# Altium schematic sheet Buzzer.SchDoc
size A4; Organization: Altium Limited; Address1: L3, 12a Rodborough Rd; Address2: Frenchs Forest; Address3: NSW; Address4: Australia 2086; DocumentNumber: 2; SheetNumber: 2; SheetTotal: 3
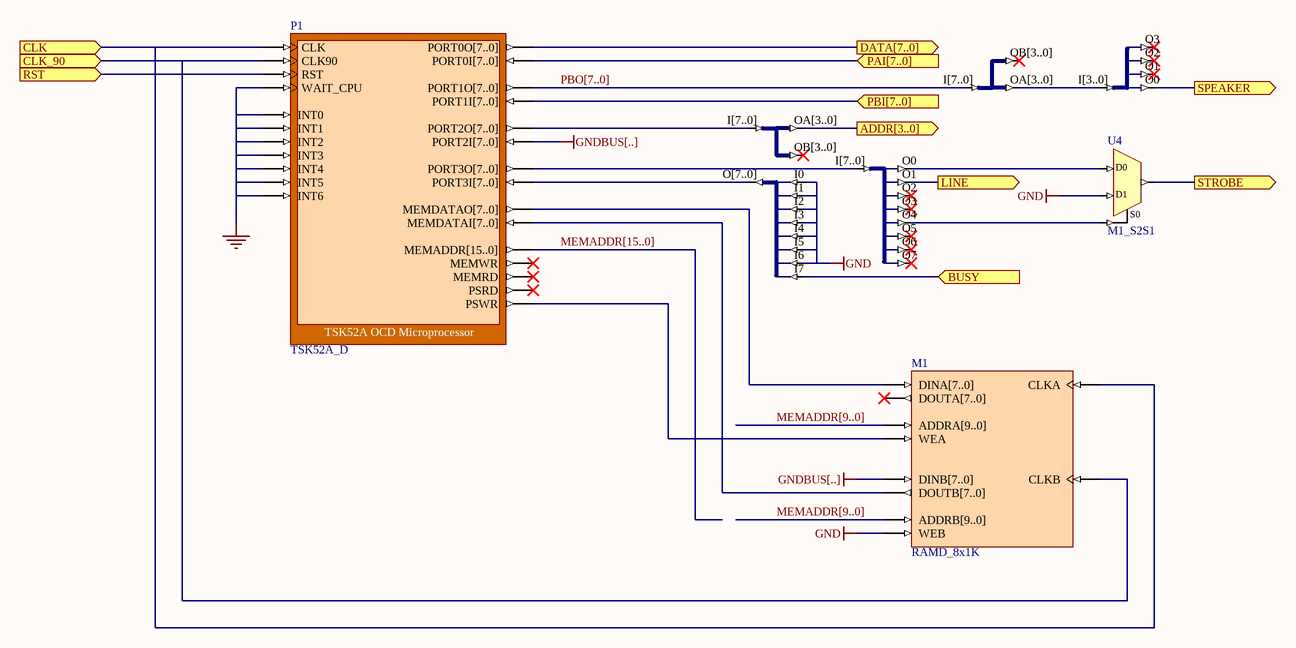
[diagram p0: Buzzer.SchDoc]

## Parts
M1  RAMD_8x1K
P1  TSK52A_D
U1  J4B_4S  (value not drawn)
U2  J8B_4B2  (value not drawn)
U3  J8B_4B2  (value not drawn)
U4  M1_S2S1
U5  J8B_8S  (value not drawn)
U6  J8S_8B  (value not drawn)

## Ports
ADDR[3..0] (out), BUSY (in), CLK (in), CLK_90 (in), DATA[7..0] (out), LINE (out), PAI[7..0] (in), PBI[7..0] (in), RST (in), SPEAKER (out), STROBE (out)

## Nets
GND: M1.WEB P1.INT0 P1.INT1 P1.INT2 P1.INT3 P1.INT4 P1.INT5 P1.INT6 P1.WAIT_CPU U4.D1 U6.I0 U6.I1 U6.I2 U6.I3 U6.I4 U6.I5 U6.I6
GNDBUS[..]: M1.DINB[7..0] P1.PORT2I[7..0]
ADDR[3..0]: U3.OA[3..0] ; port ADDR[3..0]
BUSY: U6.I7 ; port BUSY
CLK: M1.CLKA P1.CLK ; port CLK
CLK_90: M1.CLKB P1.CLK90 ; port CLK_90
DATA[7..0]: P1.PORT0O[7..0] ; port DATA[7..0]
LINE: U5.O1 ; port LINE
MEMADDR[9..0]: M1.ADDRA[9..0] M1.ADDRB[9..0]
MEMADDR[15..0]: P1.MEMADDR[15..0]
PAI[7..0]: P1.PORT0I[7..0] ; port PAI[7..0]
PBI[7..0]: P1.PORT1I[7..0] ; port PBI[7..0]
PBO[7..0]: P1.PORT1O[7..0] U2.I[7..0]
RST: P1.RST ; port RST
SPEAKER: U1.O0 ; port SPEAKER
STROBE: U4.O ; port STROBE
NetM1_DINA[7..0]: M1.DINA[7..0] P1.MEMDATAO[7..0]
NetM1_DOUTB[7..0]: M1.DOUTB[7..0] P1.MEMDATAI[7..0]
NetM1_WEA: M1.WEA P1.PSWR
NetP1_PORT2O[7..0]: P1.PORT2O[7..0] U3.I[7..0]
NetP1_PORT3I[7..0]: P1.PORT3I[7..0] U6.O[7..0]
NetP1_PORT3O[7..0]: P1.PORT3O[7..0] U5.I[7..0]
NetU1_I[3..0]: U1.I[3..0] U2.OA[3..0]
NetU4_D0: U4.D0 U5.O0
NetU4_S0: U4.S0 U5.O4

Not connected (* = marked no-connect by the designer): M1 DOUTA[7..0]*; P1 MEMRD* MEMWR* PSRD*; U1 O1* O2* O3*; U2 OB[3..0]*; U3 OB[3..0]*; U5 O2* O3* O5* O6* O7*

## Buses and harness runs
bus MEMADDR[9..0]
bus MEMADDR[15..0]
bus PBO[7..0]

## Notes on the sheet
- Title
- Size:
- Date:
- A4
- Number:
- Time:
- Revision:
- Sheet
- of
- File:

## Library data of the parts
M1 = RAMD_8x1K: Dual Port Random Access Memory; Memory_DepthA: 1024; Memory_Type: RAM_DualPortBlock; Memory_WidthA: 8; Memory_ClockEdge: Rising; Nexus_Core: Memory_Program; Published: 13/01/2004; Publisher: Altium Hobart Technology Center; Memory_DepthB: 1024; Memory_WidthB: 8
P1 = TSK52A_D: TSK52A OCD Microprocessor; NEXUS_CORE: Processor_OCDS; NEXUS_JTAG_DEVICE: True; NEXUS_JTAG_ORDER: 0; ChildModel1: TSK52A_D_DRAM8X256; ChildCore1: M1; Published: 1/12/2003; Publisher: Altium Hobart Technology Centre; Core Revision: 1.00.00
U1 = J4B_4S: 4-Bit input bus to 4 Single pin outputs; ArchiveName: GENERIC; VHDLIB_SIM: GENERIC_LIB; Published: 29-Jan-2004; Publisher: Altium Limited; Core Revision: 1.00.00
U2 = J8B_4B2: 1 x 8-bit input bus to 2 x 4-Bit output bus; ArchiveName: GENERIC; VHDLIB_SIM: GENERIC_LIB; Published: 29-Jan-2004; Publisher: Altium Limited; Core Revision: 1.00.00
U3 = J8B_4B2: 1 x 8-bit input bus to 2 x 4-Bit output bus; ArchiveName: GENERIC; Published: 18-Dec-2003; Publisher: Altium Limited; Core Revision: 1.00.00
U4 = M1_S2S1: 2x1-Single Wire to 1x1-Single Wire Multiplexer; Xilinx Equivalent: M2_1; ArchiveName: GENERIC; VHDLIB_SIM: GENERIC_LIB; Published: 28-Jan-2004; Publisher: Altium Limited; Core Revision: 1.00.00
U5 = J8B_8S: 8-Bit input bus to 8 single pin outputs; ArchiveName: GENERIC; Published: 18-Dec-2003; Publisher: Altium Limited; Core Revision: 1.00.00
U6 = J8S_8B: 8 Single pin inputs to single 8-Bit output bus; ArchiveName: GENERIC; Published: 18-Dec-2003; Publisher: Altium Limited; Core Revision: 1.00.00